# Altium project Control Logic.PrjPcb
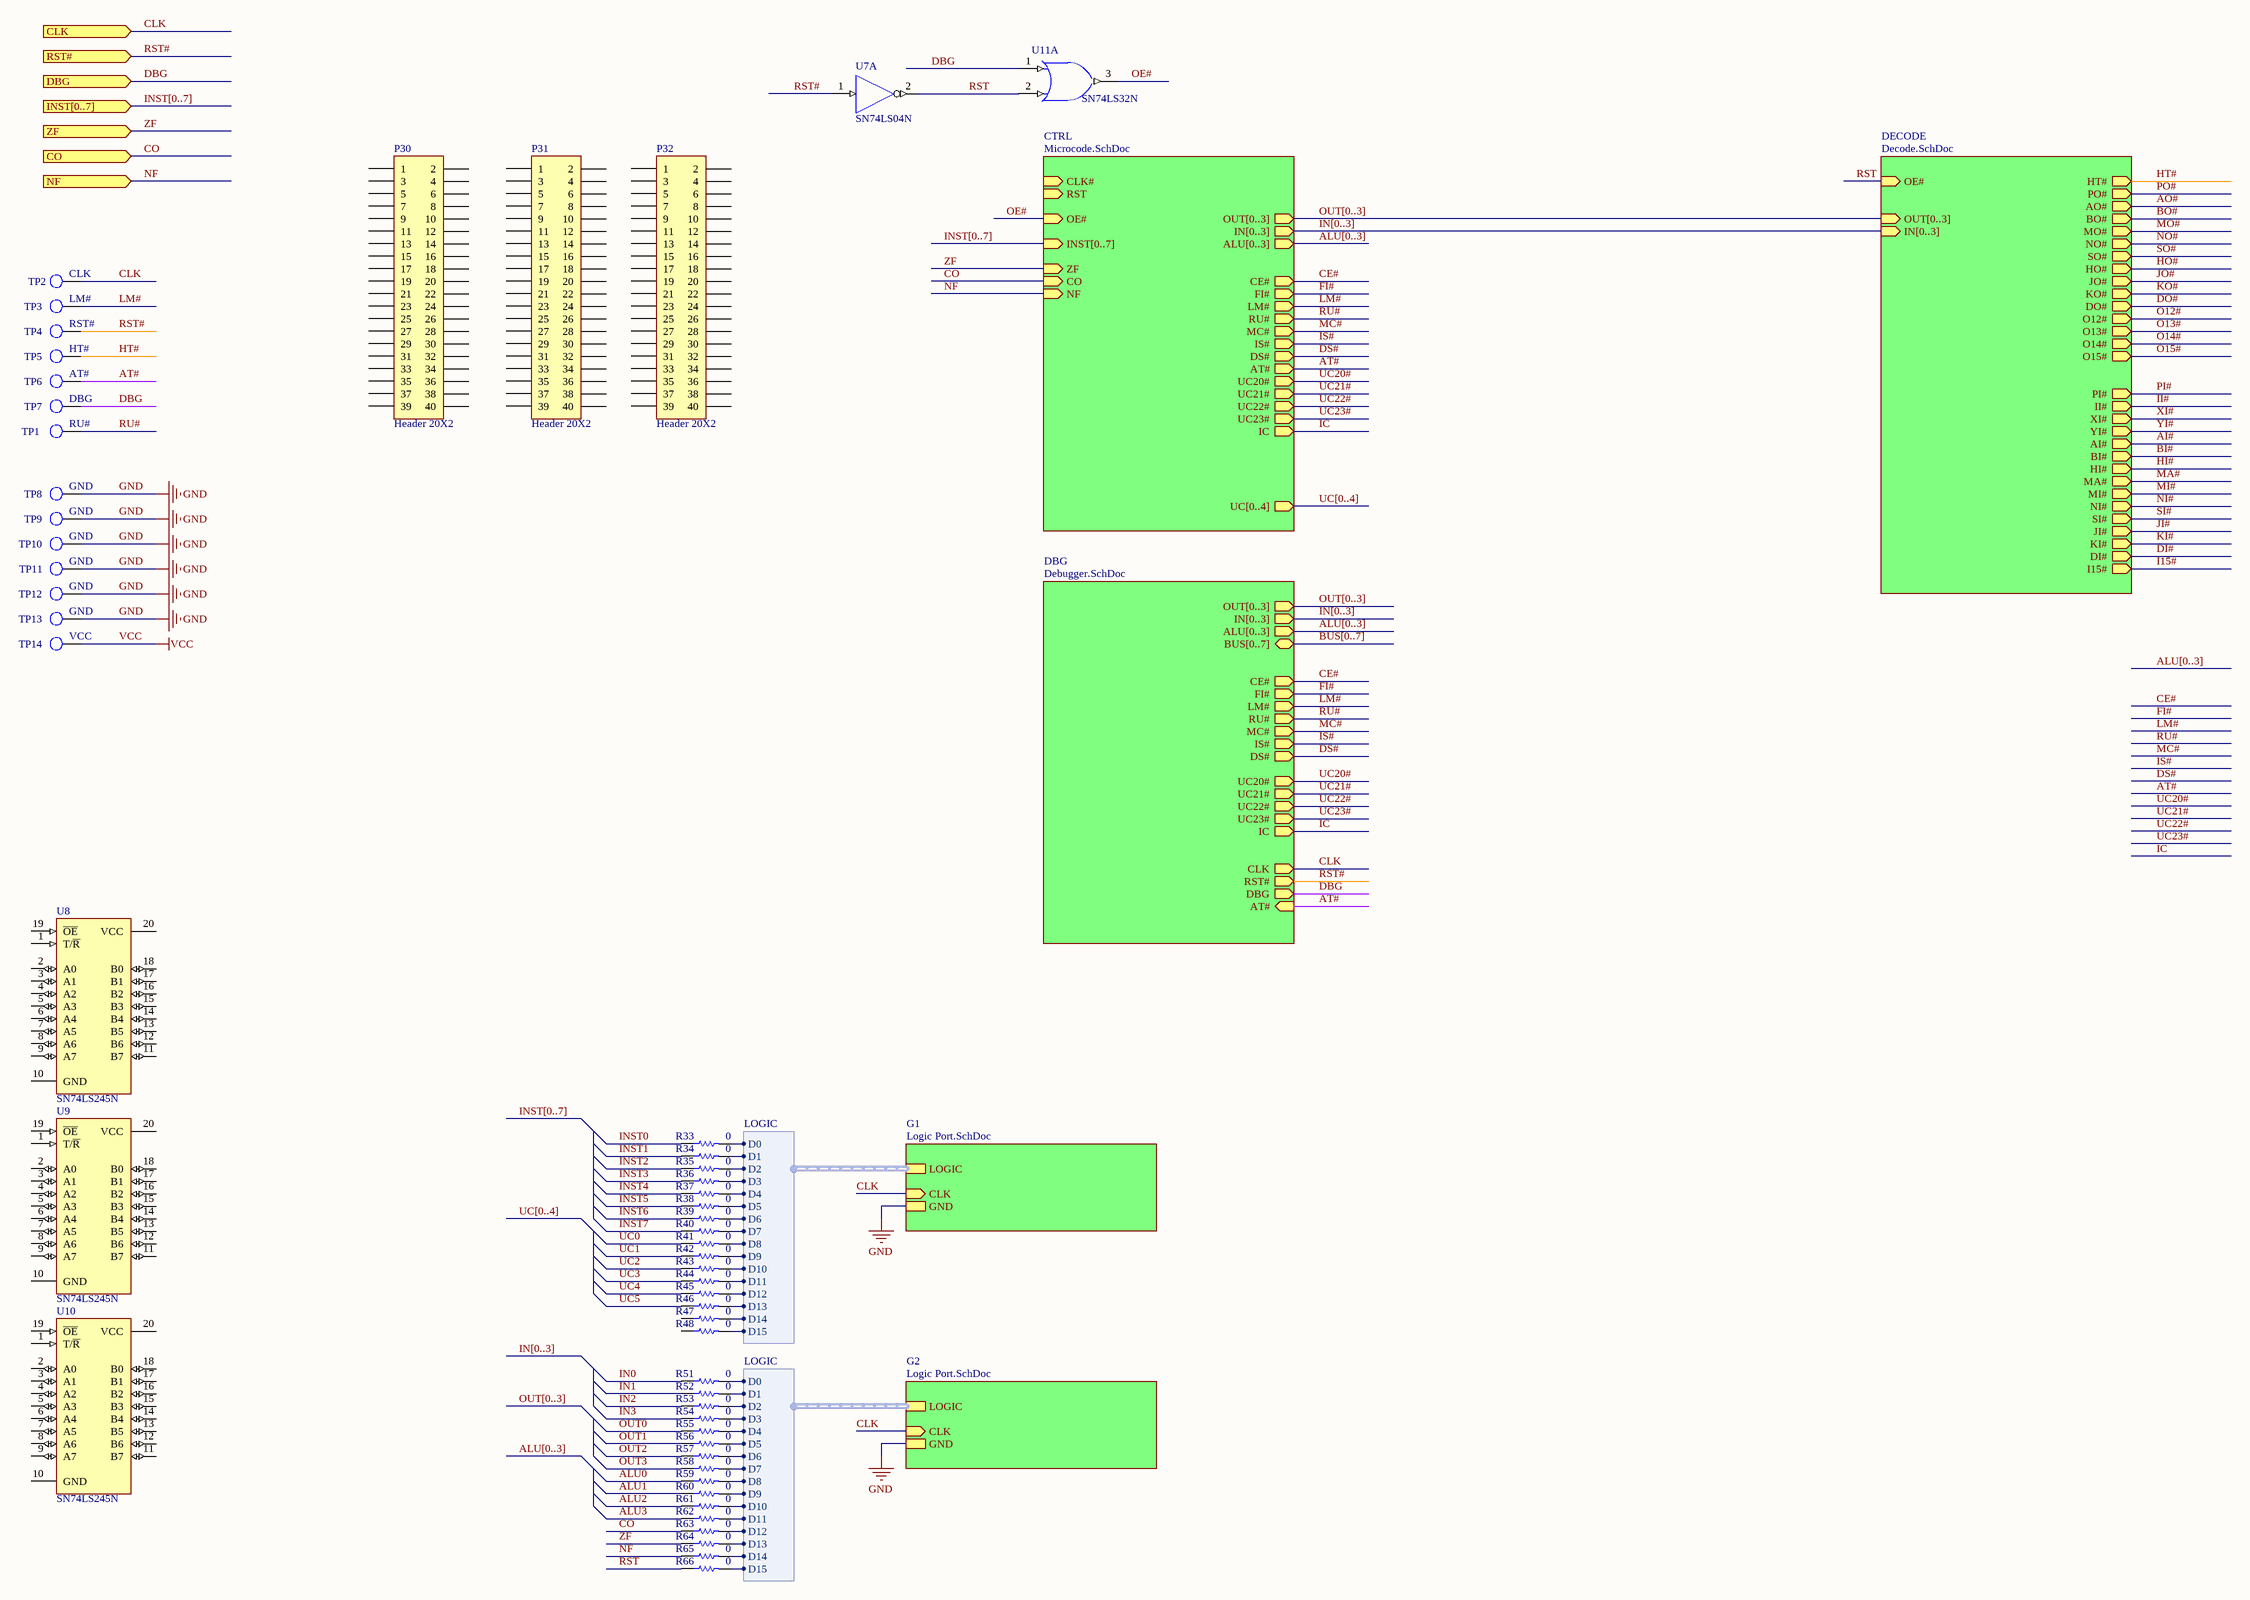
[diagram p0: Top.SchDoc]
4 sheets, 230 parts. Net scope: hierarchical (ports join the sheet entries above them; power ports are global).
Board file: Control Logic.PcbDoc
Sheets:
  Top.SchDoc
    CTRL = Microcode.SchDoc
    G1 = Logic Port.SchDoc
    DECODE = Decode.SchDoc
    G2 = Logic Port.SchDoc

## Sheet Top.SchDoc
size C; Author: E. Sims; Organization: Let's Build Rockets Inc.; SheetNumber: 1; SheetTotal: 5

### Parts
P30  Header 20X2  [HDR2X20]
P31  Header 20X2  [HDR2X20]
P32  Header 20X2  [HDR2X20]
R33  value 0  [AXIAL-0.3]  (hidden comment: Res1)
R34  value 0  [AXIAL-0.3]  (hidden comment: Res1)
R35  value 0  [AXIAL-0.3]  (hidden comment: Res1)
R36  value 0  [AXIAL-0.3]  (hidden comment: Res1)
R37  value 0  [AXIAL-0.3]  (hidden comment: Res1)
R38  value 0  [AXIAL-0.3]  (hidden comment: Res1)
R39  value 0  [AXIAL-0.3]  (hidden comment: Res1)
R40  value 0  [AXIAL-0.3]  (hidden comment: Res1)
R41  value 0  [AXIAL-0.3]  (hidden comment: Res1)
R42  value 0  [AXIAL-0.3]  (hidden comment: Res1)
R43  value 0  [AXIAL-0.3]  (hidden comment: Res1)
R44  value 0  [AXIAL-0.3]  (hidden comment: Res1)
R45  value 0  [AXIAL-0.3]  (hidden comment: Res1)
R46  value 0  [AXIAL-0.3]  (hidden comment: Res1)
R47  value 0  [AXIAL-0.3]  (hidden comment: Res1)
R48  value 0  [AXIAL-0.3]  (hidden comment: Res1)
R51  value 0  [AXIAL-0.3]  (hidden comment: Res1)
R52  value 0  [AXIAL-0.3]  (hidden comment: Res1)
R53  value 0  [AXIAL-0.3]  (hidden comment: Res1)
R54  value 0  [AXIAL-0.3]  (hidden comment: Res1)
R55  value 0  [AXIAL-0.3]  (hidden comment: Res1)
R56  value 0  [AXIAL-0.3]  (hidden comment: Res1)
R57  value 0  [AXIAL-0.3]  (hidden comment: Res1)
R58  value 0  [AXIAL-0.3]  (hidden comment: Res1)
R59  value 0  [AXIAL-0.3]  (hidden comment: Res1)
R60  value 0  [AXIAL-0.3]  (hidden comment: Res1)
R61  value 0  [AXIAL-0.3]  (hidden comment: Res1)
R62  value 0  [AXIAL-0.3]  (hidden comment: Res1)
R63  value 0  [AXIAL-0.3]  (hidden comment: Res1)
R64  value 0  [AXIAL-0.3]  (hidden comment: Res1)
R65  value 0  [AXIAL-0.3]  (hidden comment: Res1)
R66  value 0  [AXIAL-0.3]  (hidden comment: Res1)
TP1  RU#  [KSTN-5011_V]  (no BOM)
TP2  CLK  [KSTN-5011_V]  (no BOM)
TP3  LM#  [KSTN-5011_V]  (no BOM)
TP4  RST#  [KSTN-5011_V]  (no BOM)
TP5  HT#  [KSTN-5011_V]  (no BOM)
TP6  AT#  [KSTN-5011_V]  (no BOM)
TP7  DBG  [KSTN-5011_V]  (no BOM)
TP8  GND  [KSTN-5011_V]  (no BOM)
TP9  GND  [KSTN-5011_V]  (no BOM)
TP10  GND  [KSTN-5011_V]  (no BOM)
TP11  GND  [KSTN-5011_V]  (no BOM)
TP12  GND  [KSTN-5011_V]  (no BOM)
TP13  GND  [KSTN-5011_V]  (no BOM)
TP14  VCC  [KSTN-5011_V]  (no BOM)
U7  SN74LS04N  [N014]  (part A of 6)
U8  SN74LS245N  [N020]
U9  SN74LS245N  [N020]
U10  SN74LS245N  [N020]
U11  SN74LS32N  [N014]  (part A of 4)

### Sub-sheets
CTRL = Microcode.SchDoc: NF (in), RST (in), CLK# (in), ZF (in), INST[0..7] (in), CO (in), UC[0..4] (out), IN[0..3] (out), ALU[0..3] (out), OUT[0..3] (out), OE# (in), IS# (out), UC21# (out), RU# (out), AT# (out), MC# (out), CE# (out), IC (out), UC22# (out), DS# (out), FI# (out), UC23# (out), UC20# (out), LM# (out)
DBG = Debugger.SchDoc (file not in this document): IN[0..3] (out), ALU[0..3] (out), OUT[0..3] (out), IS# (out), UC21# (out), RU# (out), MC# (out), CE# (out), IC (out), UC22# (out), DS# (out), FI# (out), UC23# (out), UC20# (out), LM# (out), CLK (out), RST# (out), DBG (out), AT# (in), BUS[0..7] (bidir)
DECODE = Decode.SchDoc: IN[0..3] (in), OUT[0..3] (in), OE# (in), PO# (out), HT# (out), NO# (out), JO# (out), BO# (out), O14# (out), SO# (out), O15# (out), KO# (out), DO# (out), AO# (out), O12# (out), O13# (out), MO# (out), HO# (out), I15# (out), JI# (out), SI# (out), PI# (out), XI# (out), MI# (out), HI# (out), II# (out), DI# (out), NI# (out), BI# (out), MA# (out), YI# (out), KI# (out), AI# (out)
G1 = Logic Port.SchDoc: GND, CLK (in), LOGIC (harness LOGIC)
G2 = Logic Port.SchDoc: GND, CLK (in), LOGIC (harness LOGIC)

### Ports
CLK (in), CO (in), DBG (in), INST[0..7] (in), NF (in), RST# (in), ZF (in)

### Harnesses
LOGIC: D0, D1, D2, D3, D4, D5, D6, D7, D8, D9, D10, D11, D12, D13, D14, D15

### Nets
GND: TP8.1 TP9.1 TP10.1 TP11.1 TP12.1 TP13.1 U7.7(GND) U11.7(GND) ; sheet G1/GND, sheet G2/GND
VCC: TP14.1 U7.14(VCC) U11.14(VCC)
ALU0: R59.1
ALU1: R60.1
ALU2: R61.1
ALU3: R62.1
AT#: TP6.1 ; sheet CTRL/AT#, sheet DBG/AT#
CE#: sheet CTRL/CE#, sheet DBG/CE#
CLK: TP2.1 ; port CLK, sheet G1/CLK, sheet G2/CLK, sheet DBG/CLK
CO: R63.1 ; port CO, sheet CTRL/CO
DBG: TP7.1 U11.1(A) ; port DBG, sheet DBG/DBG
DS#: sheet CTRL/DS#, sheet DBG/DS#
FI#: sheet CTRL/FI#, sheet DBG/FI#
HT#: TP5.1 ; sheet DECODE/HT#
IC: sheet CTRL/IC, sheet DBG/IC
IN0: R51.1
IN1: R52.1
IN2: R53.1
IN3: R54.1
INST0: R33.1
INST1: R34.1
INST2: R35.1
INST3: R36.1
INST4: R37.1
INST5: R38.1
INST6: R39.1
INST7: R40.1
IS#: sheet CTRL/IS#, sheet DBG/IS#
LM#: TP3.1 ; sheet CTRL/LM#, sheet DBG/LM#
LOGIC.D0: R33.2 ; sheet G1/LOGIC.D0
LOGIC.D0: R51.2 ; sheet G2/LOGIC.D0  [a separate net that carries the same name]
LOGIC.D1: R34.2 ; sheet G1/LOGIC.D1
LOGIC.D1: R52.2 ; sheet G2/LOGIC.D1  [a separate net that carries the same name]
LOGIC.D2: R35.2 ; sheet G1/LOGIC.D2
LOGIC.D2: R53.2 ; sheet G2/LOGIC.D2  [a separate net that carries the same name]
LOGIC.D3: R36.2 ; sheet G1/LOGIC.D3
LOGIC.D3: R54.2 ; sheet G2/LOGIC.D3  [a separate net that carries the same name]
LOGIC.D4: R37.2 ; sheet G1/LOGIC.D4
LOGIC.D4: R55.2 ; sheet G2/LOGIC.D4  [a separate net that carries the same name]
LOGIC.D5: R38.2 ; sheet G1/LOGIC.D5
LOGIC.D5: R56.2 ; sheet G2/LOGIC.D5  [a separate net that carries the same name]
LOGIC.D6: R39.2 ; sheet G1/LOGIC.D6
LOGIC.D6: R57.2 ; sheet G2/LOGIC.D6  [a separate net that carries the same name]
LOGIC.D7: R40.2 ; sheet G1/LOGIC.D7
LOGIC.D7: R58.2 ; sheet G2/LOGIC.D7  [a separate net that carries the same name]
LOGIC.D8: R41.2 ; sheet G1/LOGIC.D8
LOGIC.D8: R59.2 ; sheet G2/LOGIC.D8  [a separate net that carries the same name]
LOGIC.D9: R42.2 ; sheet G1/LOGIC.D9
LOGIC.D9: R60.2 ; sheet G2/LOGIC.D9  [a separate net that carries the same name]
LOGIC.D10: R43.2 ; sheet G1/LOGIC.D10
LOGIC.D10: R61.2 ; sheet G2/LOGIC.D10  [a separate net that carries the same name]
LOGIC.D11: R44.2 ; sheet G1/LOGIC.D11
LOGIC.D11: R62.2 ; sheet G2/LOGIC.D11  [a separate net that carries the same name]
LOGIC.D12: R45.2 ; sheet G1/LOGIC.D12
LOGIC.D12: R63.2 ; sheet G2/LOGIC.D12  [a separate net that carries the same name]
LOGIC.D13: R46.2 ; sheet G1/LOGIC.D13
LOGIC.D13: R64.2 ; sheet G2/LOGIC.D13  [a separate net that carries the same name]
LOGIC.D14: R47.2 ; sheet G1/LOGIC.D14
LOGIC.D14: R65.2 ; sheet G2/LOGIC.D14  [a separate net that carries the same name]
LOGIC.D15: R48.2 ; sheet G1/LOGIC.D15
LOGIC.D15: R66.2 ; sheet G2/LOGIC.D15  [a separate net that carries the same name]
MC#: sheet CTRL/MC#, sheet DBG/MC#
NF: R65.1 ; port NF, sheet CTRL/NF
OE#: U11.3(Y) ; sheet CTRL/OE#
OUT0: R55.1
OUT1: R56.1
OUT2: R57.1
OUT3: R58.1
RST: R66.1 U7.2(Y) U11.2(B) ; sheet DECODE/OE#  [project net OE#]
RST#: TP4.1 U7.1(A) ; port RST#, sheet DBG/RST#
RU#: TP1.1 ; sheet CTRL/RU#, sheet DBG/RU#
UC0: R41.1
UC1: R42.1
UC2: R43.1
UC3: R44.1
UC4: R45.1
UC5: R46.1
UC20#: sheet CTRL/UC20#, sheet DBG/UC20#
UC21#: sheet CTRL/UC21#, sheet DBG/UC21#
UC22#: sheet CTRL/UC22#, sheet DBG/UC22#
UC23#: sheet CTRL/UC23#, sheet DBG/UC23#
ZF: R64.1 ; port ZF, sheet CTRL/ZF

Not connected (* = marked no-connect by the designer): P30 1 2 3 4 5 6 7 8 9 10 11 12 13 14 15 16 17 18 19 20 21 22 23 24 25 26 27 28 29 30 31 32 33 34 35 36 37 38 39 40; P31 1 2 3 4 5 6 7 8 9 10 11 12 13 14 15 16 17 18 19 20 21 22 23 24 25 26 27 28 29 30 31 32 33 34 35 36 37 38 39 40; P32 1 2 3 4 5 6 7 8 9 10 11 12 13 14 15 16 17 18 19 20 21 22 23 24 25 26 27 28 29 30 31 32 33 34 35 36 37 38 39 40; R47 1; R48 1; U8 1(T/~{R}) 2(A0) 3(A1) 4(A2) 5(A3) 6(A4) 7(A5) 8(A6) 9(A7) 10(GND) 11(B7) 12(B6) 13(B5) 14(B4) 15(B3) 16(B2) 17(B1) 18(B0) 19(~{OE}) 20(VCC); U9 1(T/~{R}) 2(A0) 3(A1) 4(A2) 5(A3) 6(A4) 7(A5) 8(A6) 9(A7) 10(GND) 11(B7) 12(B6) 13(B5) 14(B4) 15(B3) 16(B2) 17(B1) 18(B0) 19(~{OE}) 20(VCC); U10 1(T/~{R}) 2(A0) 3(A1) 4(A2) 5(A3) 6(A4) 7(A5) 8(A6) 9(A7) 10(GND) 11(B7) 12(B6) 13(B5) 14(B4) 15(B3) 16(B2) 17(B1) 18(B0) 19(~{OE}) 20(VCC)

### Buses and harness runs
bus ALU[0..3]
bus ALU[0..3] = sheet CTRL/ALU[0..3]
bus ALU[0..3] = sheet DBG/ALU[0..3]
bus BUS[0..7] = sheet DBG/BUS[0..7]
bus IN[0..3]
bus IN[0..3] = sheet CTRL/IN[0..3] = sheet DECODE/IN[0..3]
bus IN[0..3] = sheet DBG/IN[0..3]
bus INST[0..7]
bus INST[0..7] = port INST[0..7]
bus INST[0..7] = sheet CTRL/INST[0..7]
bus OUT[0..3]
bus OUT[0..3] = sheet CTRL/OUT[0..3] = sheet DECODE/OUT[0..3]
bus OUT[0..3] = sheet DBG/OUT[0..3]
bus UC[0..4]
bus UC[0..4] = sheet CTRL/UC[0..4]

### Notes on the sheet
- Let's Build Rocket's Inc. Modular Paylaod System Based on TMP-010 Rev
  For more information visit https://github.com/LetsBuildRockets/Modular-Payload-System
  This work is licensed under CC BY-NC 4.0. To view a copy of this license, visit https://creativecommons.org/licenses/by-nc/4.0
- Title
- Size:
- Date:
- Assembly Variant:
- B
- Number:
- Time:
- Revision:
- Sheet
- of
- Author:
- File:

### Library data of the parts
P30-P32 = Header 20X2: Header, 20-Pin, Dual row; System: Connector; LatestRevisionDate: 17-Jul-2002; LatestRevisionNote: Re-released for DXP Platform.; Publisher: Altium Limited
R33-R48 R51-R66 = Res1: Resistor; Published: 8-Jun-2000; LatestRevisionDate: 17-Jul-2002; LatestRevisionNote: Re-released for DXP Platform.; PackageReference: AXIAL-0.3; Publisher: Altium Limited; PackageDescription: Axial Device, Thru-Hole; 2 Leads; 0.3 in Pin Spacing
TP1-TP14 = TP
U7 = SN74LS04N: Hex Inverter; Published: 8-Jun-2000; LatestRevisionDate: 04-Mar-2005; LatestRevisionNote: Stylized 3D Model Added.; DatasheetVersion: Mar-1988; PackageVersion: Oct-1995; PackageReference: N014; Publisher: Altium Limited; PackageDescription: DIP; 14 Leads; Row Spacing 7.62 mm; Pitch 2.54 mm; ComponentLink1Description: Manufacturer Link; ComponentLink1URL: http://www.ti.com/; ComponentLink2Description: Datasheet; ComponentLink2URL: http://www-s.ti.com/sc/ds/sn74ls04.pdf
U8-U10 = SN74LS245N: Octal Bus Transceiver with 3-State Outputs; Published: 8-Jun-2000; LatestRevisionDate: 04-Mar-2005; LatestRevisionNote: Stylized 3D Model Added.; DatasheetVersion: Mar-1988; PackageVersion: Oct-1995; PackageReference: N020; Publisher: Altium Limited; PackageDescription: DIP; 20 Leads; Row Spacing 7.62 mm; Pitch 2.54 mm; ComponentLink1Description: Manufacturer Link; ComponentLink1URL: http://www.ti.com/; ComponentLink2Description: Datasheet; ComponentLink2URL: http://www-s.ti.com/sc/ds/sn74ls245.pdf
U11 = SN74LS32N: Quadruple 2-Input Positive-OR Gate; Published: 8-Jun-2000; LatestRevisionDate: 04-Mar-2005; LatestRevisionNote: Stylized 3D Model Added.; DatasheetVersion: Mar-1988; PackageVersion: Oct-1995; PackageReference: N014; Publisher: Altium Limited; PackageDescription: DIP; 14 Leads; Row Spacing 7.62 mm; Pitch 2.54 mm; ComponentLink1Description: Manufacturer Link; ComponentLink1URL: http://www.ti.com/; ComponentLink2Description: Datasheet; ComponentLink2URL: http://www-s.ti.com/sc/ds/sn74ls32.pdf

## Sheet Microcode.SchDoc
size B; Author: E. Sims; Organization: Let's Build Rockets Inc.; SheetNumber: 2; SheetTotal: 5
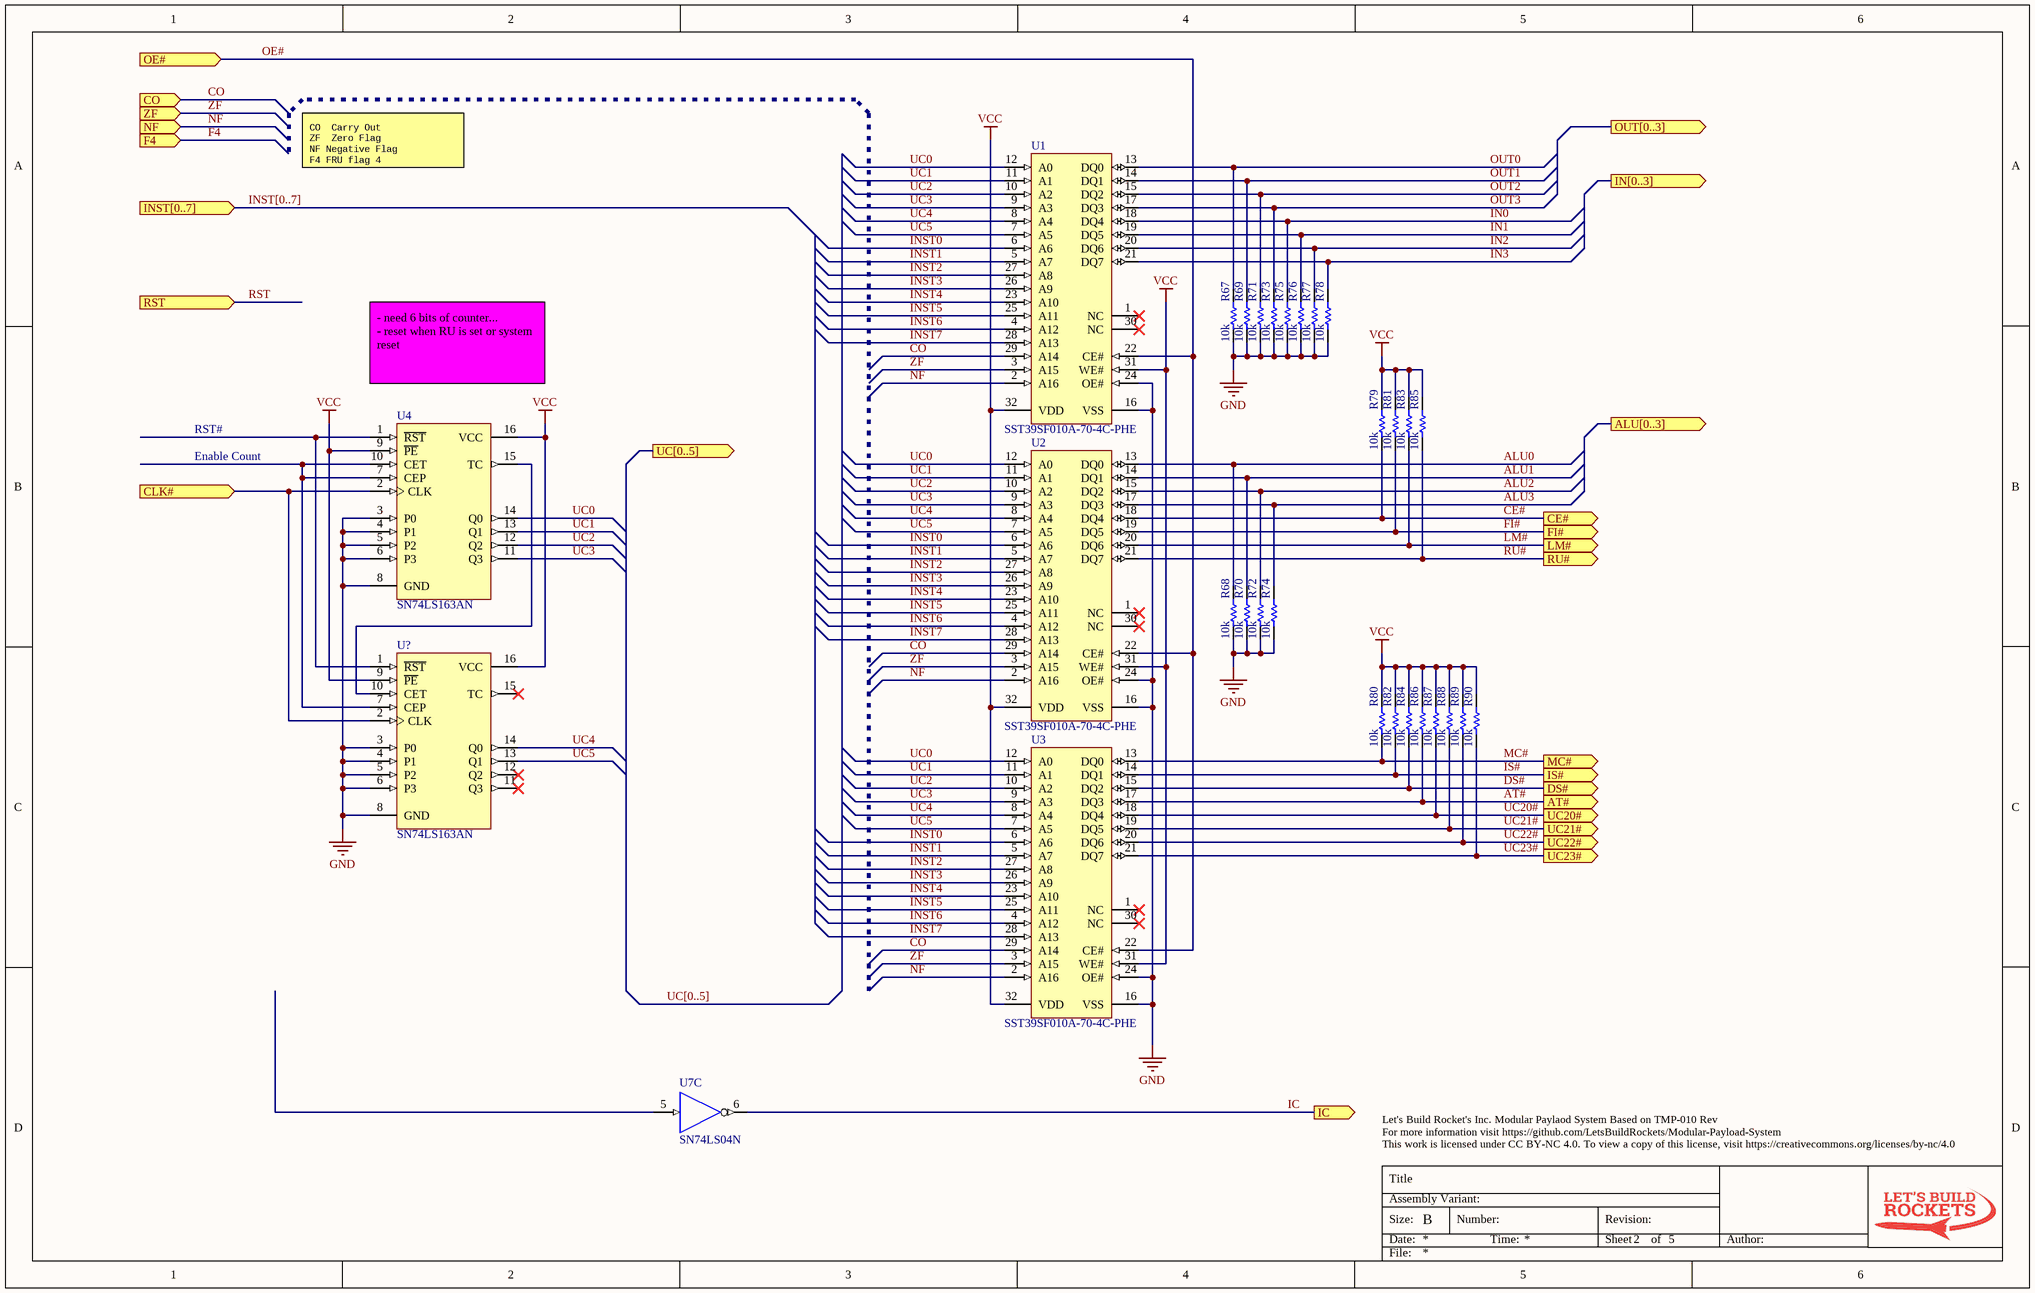
[diagram p1: Microcode.SchDoc]

### Parts
R67  value 10k  [AXIAL-0.3]  (hidden comment: Res1)
R68  value 10k  [AXIAL-0.3]  (hidden comment: Res1)
R69  value 10k  [AXIAL-0.3]  (hidden comment: Res1)
R70  value 10k  [AXIAL-0.3]  (hidden comment: Res1)
R71  value 10k  [AXIAL-0.3]  (hidden comment: Res1)
R72  value 10k  [AXIAL-0.3]  (hidden comment: Res1)
R73  value 10k  [AXIAL-0.3]  (hidden comment: Res1)
R74  value 10k  [AXIAL-0.3]  (hidden comment: Res1)
R75  value 10k  [AXIAL-0.3]  (hidden comment: Res1)
R76  value 10k  [AXIAL-0.3]  (hidden comment: Res1)
R77  value 10k  [AXIAL-0.3]  (hidden comment: Res1)
R78  value 10k  [AXIAL-0.3]  (hidden comment: Res1)
R79  value 10k  [AXIAL-0.3]  (hidden comment: Res1)
R80  value 10k  [AXIAL-0.3]  (hidden comment: Res1)
R81  value 10k  [AXIAL-0.3]  (hidden comment: Res1)
R82  value 10k  [AXIAL-0.3]  (hidden comment: Res1)
R83  value 10k  [AXIAL-0.3]  (hidden comment: Res1)
R84  value 10k  [AXIAL-0.3]  (hidden comment: Res1)
R85  value 10k  [AXIAL-0.3]  (hidden comment: Res1)
R86  value 10k  [AXIAL-0.3]  (hidden comment: Res1)
R87  value 10k  [AXIAL-0.3]  (hidden comment: Res1)
R88  value 10k  [AXIAL-0.3]  (hidden comment: Res1)
R89  value 10k  [AXIAL-0.3]  (hidden comment: Res1)
R90  value 10k  [AXIAL-0.3]  (hidden comment: Res1)
U1  SST39SF010A-70-4C-PHE  [MCHP-PDIP-PH32]
U2  SST39SF010A-70-4C-PHE  [MCHP-PDIP-PH32]
U3  SST39SF010A-70-4C-PHE  [MCHP-PDIP-PH32]
U4  SN74LS163AN  [N016]
U7  SN74LS04N  [N014]  (part C of 6)
U?  SN74LS163AN  [N016]

### Ports
ALU[0..3] (out), AT# (out), CE# (out), CLK# (in), CO (in), DS# (out), F4 (in), FI# (out), IC (out), IN[0..3] (out), INST[0..7] (in), IS# (out), LM# (out), MC# (out), NF (in), OE# (in), OUT[0..3] (out), RST (in), RU# (out), UC20# (out), UC21# (out), UC22# (out), UC23# (out), UC[0..5] (out), ZF (in)

### Nets
GND: R67.1 R68.1 R69.1 R70.1 R71.1 R72.1 R73.1 R74.1 R75.1 R76.1 R77.1 R78.1 U1.16(VSS) U1.24(OE#) U2.16(VSS) U2.24(OE#) U3.16(VSS) U3.24(OE#) U4.3(P0) U4.4(P1) U4.5(P2) U4.6(P3) U4.8(GND) U7.7(GND) U?.3(P0) U?.4(P1) U?.5(P2) U?.6(P3) U?.8(GND)
VCC: R79.2 R80.2 R81.2 R82.2 R83.2 R84.2 R85.2 R86.2 R87.2 R88.2 R89.2 R90.2 U1.31(WE#) U1.32(VDD) U2.31(WE#) U2.32(VDD) U3.31(WE#) U3.32(VDD) U4.9(~{PE}) U4.16(VCC) U7.14(VCC) U?.9(~{PE}) U?.16(VCC)
ALU0: R68.2 U2.13(DQ0)
ALU1: R70.2 U2.14(DQ1)
ALU2: R72.2 U2.15(DQ2)
ALU3: R74.2 U2.17(DQ3)
AT#: R86.1 U3.17(DQ3) ; port AT#
CE#: R79.1 U2.18(DQ4) ; port CE#
CO: U1.29(A14) U2.29(A14) U3.29(A14) ; port CO
DS#: R84.1 U3.15(DQ2) ; port DS#
F4: port F4
FI#: R81.1 U2.19(DQ5) ; port FI#
IC: U7.6(Y) ; port IC
IN0: R75.2 U1.18(DQ4)
IN1: R76.2 U1.19(DQ5)
IN2: R77.2 U1.20(DQ6)
IN3: R78.2 U1.21(DQ7)
INST0: U1.6(A6) U2.6(A6) U3.6(A6)
INST1: U1.5(A7) U2.5(A7) U3.5(A7)
INST2: U1.27(A8) U2.27(A8) U3.27(A8)
INST3: U1.26(A9) U2.26(A9) U3.26(A9)
INST4: U1.23(A10) U2.23(A10) U3.23(A10)
INST5: U1.25(A11) U2.25(A11) U3.25(A11)
INST6: U1.4(A12) U2.4(A12) U3.4(A12)
INST7: U1.28(A13) U2.28(A13) U3.28(A13)
IS#: R82.1 U3.14(DQ1) ; port IS#
LM#: R83.1 U2.20(DQ6) ; port LM#
MC#: R80.1 U3.13(DQ0) ; port MC#
NF: U1.2(A16) U2.2(A16) U3.2(A16) ; port NF
OE#: U1.22(CE#) U2.22(CE#) U3.22(CE#) ; port OE#
OUT0: R67.2 U1.13(DQ0)
OUT1: R69.2 U1.14(DQ1)
OUT2: R71.2 U1.15(DQ2)
OUT3: R73.2 U1.17(DQ3)
RST: port RST
RU#: R85.1 U2.21(DQ7) ; port RU#
UC0: U1.12(A0) U2.12(A0) U3.12(A0) U4.14(Q0)
UC1: U1.11(A1) U2.11(A1) U3.11(A1) U4.13(Q1)
UC2: U1.10(A2) U2.10(A2) U3.10(A2) U4.12(Q2)
UC3: U1.9(A3) U2.9(A3) U3.9(A3) U4.11(Q3)
UC4: U1.8(A4) U2.8(A4) U3.8(A4) U?.14(Q0)
UC5: U1.7(A5) U2.7(A5) U3.7(A5) U?.13(Q1)
UC20#: R87.1 U3.18(DQ4) ; port UC20#
UC21#: R88.1 U3.19(DQ5) ; port UC21#
UC22#: R89.1 U3.20(DQ6) ; port UC22#
UC23#: R90.1 U3.21(DQ7) ; port UC23#
ZF: U1.3(A15) U2.3(A15) U3.3(A15) ; port ZF
NetU4_1: U4.1(~{RST}) U?.1(~{RST})
NetU4_2: U4.2(CLK) U?.2(CLK) ; port CLK#
NetU4_7: U4.7(CEP) U4.10(CET) U?.7(CEP)
NetU4_15: U4.15(TC) U?.10(CET)

Not connected (* = marked no-connect by the designer): U1 1(NC)* 30(NC)*; U2 1(NC)* 30(NC)*; U3 1(NC)* 30(NC)*; U7 5(A); U? 11(Q3)* 12(Q2)* 15(TC)*

### Buses and harness runs
bus INST[0..7] = port INST[0..7]
bus UC[0..5] = port UC[0..5]

### Notes on the sheet
- CO  Carry Out
  ZF  Zero Flag
  NF Negative Flag
  F4 FRU flag 4
- RST#
- - need 6 bits of counter...
  - reset when RU is set or system reset
- Enable Count
- Let's Build Rocket's Inc. Modular Paylaod System Based on TMP-010 Rev
  For more information visit https://github.com/LetsBuildRockets/Modular-Payload-System
  This work is licensed under CC BY-NC 4.0. To view a copy of this license, visit https://creativecommons.org/licenses/by-nc/4.0
- Title
- Size:
- Date:
- Assembly Variant:
- B
- Number:
- Time:
- Revision:
- Sheet
- of
- Author:
- File:

### Library data of the parts
R67-R90 = Res1: Resistor; Published: 8-Jun-2000; LatestRevisionDate: 17-Jul-2002; LatestRevisionNote: Re-released for DXP Platform.; PackageReference: AXIAL-0.3; Publisher: Altium Limited; PackageDescription: Axial Device, Thru-Hole; 2 Leads; 0.3 in Pin Spacing
U1-U3 = CMP-0378-00001-1: 1 Mbit Multi-Purpose Flash, 4.5 to 5.5 V, 1 kHz, 0 to 70 degC, 32-pin PDIP (PH32), Tube; Manufacturer: Microchip; ComponentLink3Description: Package Specification; ComponentLink1URL: http://www.microchip.com; ComponentLink2Description: Datasheet; PackageReference: PDIP-PH32; ComponentLink2URL: http://ww1.microchip.com/downloads/en/DeviceDoc/25022A.pdf; DatasheetVersion: Rev. A; ComponentLink3URL: http://ww1.microchip.com/downloads/en/DeviceDoc/25022A.pdf; ComponentLink4Description: Product URL; ComponentLink1Description: Manufacturer URL; PartNumber: SST39SF010A-70-4C-PHE; ComponentLink4URL: http://www.microchip.com/SST39SF010A; PackageDescription: 32-Pin Plastic Dual In-line Pins, Row Spacing 15.24 mm, 41.91 x 13.72 mm Body, 2.54 mm Pitch; Code_JEDEC: MO-015; Mounting Technology: Through Hole; PackageVersion: Rev. A
U4 U? = SN74LS163AN: Synchronous 4-Bit Counter; Published: 8-Jun-2000; LatestRevisionDate: 04-Mar-2005; LatestRevisionNote: Stylized 3D Model Added.; DatasheetVersion: Mar-1988; PackageVersion: Oct-1995; PackageReference: N016; Publisher: Altium Limited; PackageDescription: DIP; 16 Leads; Row Spacing 7.62 mm; Pitch 2.54 mm; ComponentLink1Description: Manufacturer Link; ComponentLink1URL: http://www.ti.com/; ComponentLink2Description: Datasheet; ComponentLink2URL: http://www-s.ti.com/sc/ds/sn74ls161a.pdf; ComponentLink3Description: URL Link1; ComponentLink3URL: http://focus.ti.com/docs/prod/folders/print/sn74ls163a.html; Code_JEDEC: MS-001-BB
U7 = SN74LS04N: Hex Inverter; Published: 8-Jun-2000; LatestRevisionDate: 04-Mar-2005; LatestRevisionNote: Stylized 3D Model Added.; DatasheetVersion: Mar-1988; PackageVersion: Oct-1995; PackageReference: N014; Publisher: Altium Limited; PackageDescription: DIP; 14 Leads; Row Spacing 7.62 mm; Pitch 2.54 mm; ComponentLink1Description: Manufacturer Link; ComponentLink1URL: http://www.ti.com/; ComponentLink2Description: Datasheet; ComponentLink2URL: http://www-s.ti.com/sc/ds/sn74ls04.pdf

## Sheet Logic Port.SchDoc
size B; Author: E. Sims; Organization: Let's Build Rockets Inc.; SheetNumber: 4; SheetTotal: 4
Used 2 times, as channels G1, G2. Parts and nets are listed once, with the designators drawn on the sheet.
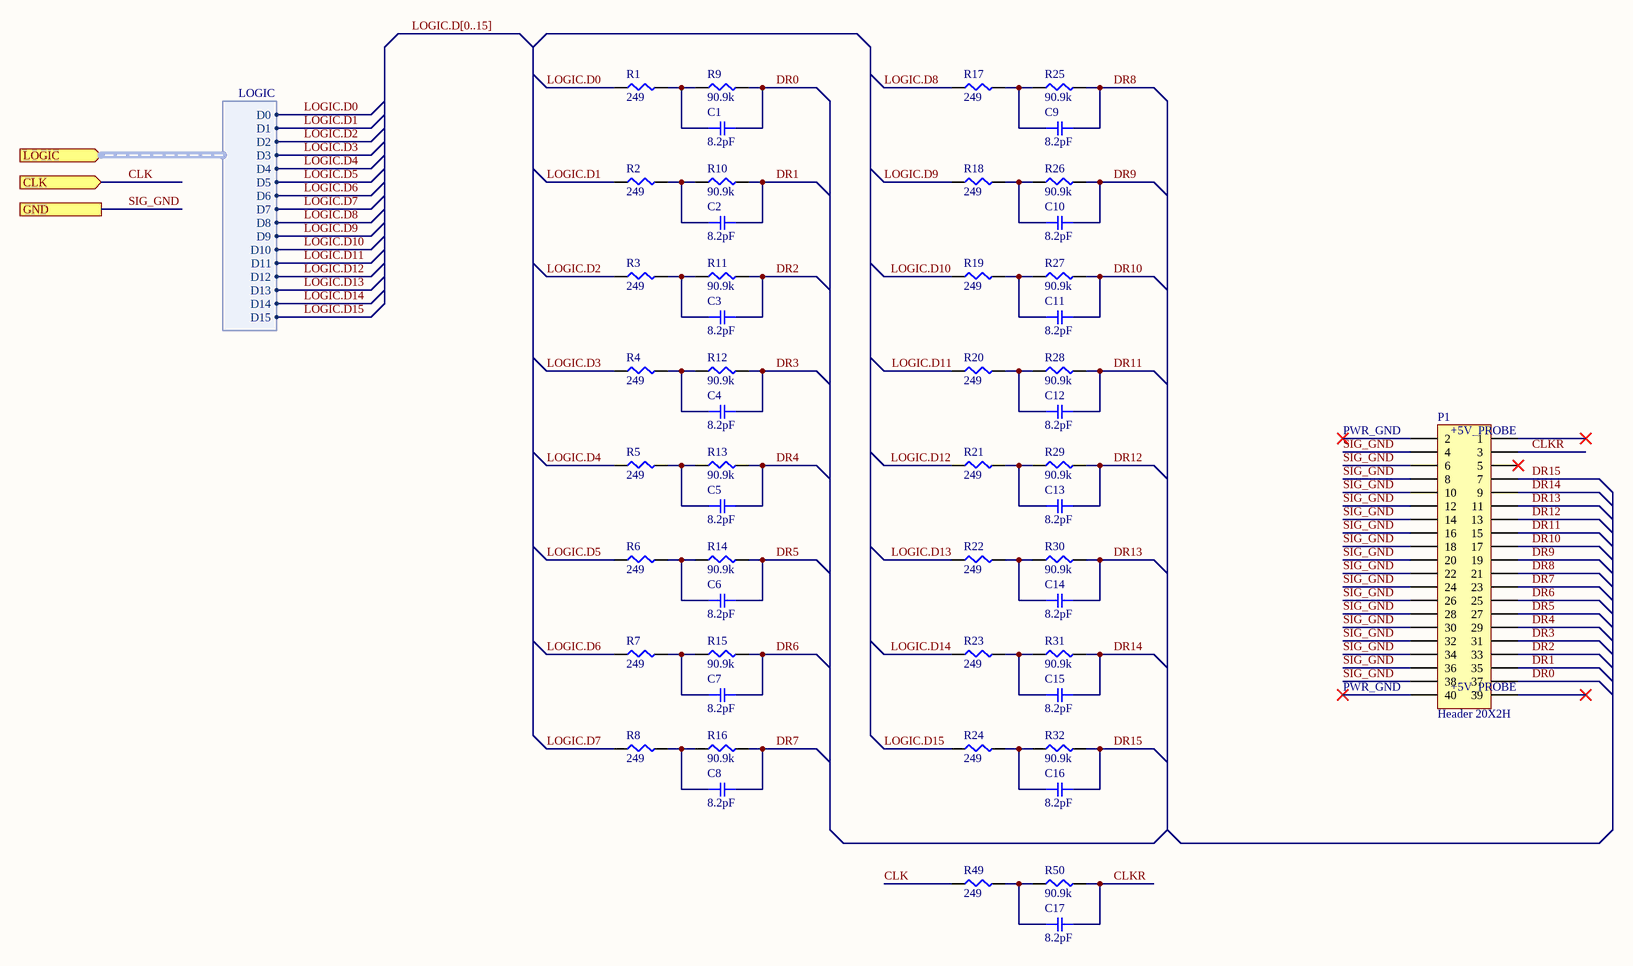
[diagram p2: Logic Port.SchDoc]

### Parts
C1  8.2pF  [SMD-0603C]
C2  8.2pF  [SMD-0603C]
C3  8.2pF  [SMD-0603C]
C4  8.2pF  [SMD-0603C]
C5  8.2pF  [SMD-0603C]
C6  8.2pF  [SMD-0603C]
C7  8.2pF  [SMD-0603C]
C8  8.2pF  [SMD-0603C]
C9  8.2pF  [SMD-0603C]
C10  8.2pF  [SMD-0603C]
C11  8.2pF  [SMD-0603C]
C12  8.2pF  [SMD-0603C]
C13  8.2pF  [SMD-0603C]
C14  8.2pF  [SMD-0603C]
C15  8.2pF  [SMD-0603C]
C16  8.2pF  [SMD-0603C]
C17  8.2pF  [SMD-0603C]
P1  Header 20X2H  [HDR2X20H]
R1  249  [SMD-0603-RES]
R2  249  [SMD-0603-RES]
R3  249  [SMD-0603-RES]
R4  249  [SMD-0603-RES]
R5  249  [SMD-0603-RES]
R6  249  [SMD-0603-RES]
R7  249  [SMD-0603-RES]
R8  249  [SMD-0603-RES]
R9  value 90.9k  [SMD-0603-RES]
R10  90.9k  [SMD-0603-RES]
R11  90.9k  [SMD-0603-RES]
R12  90.9k  [SMD-0603-RES]
R13  90.9k  [SMD-0603-RES]
R14  90.9k  [SMD-0603-RES]
R15  90.9k  [SMD-0603-RES]
R16  90.9k  [SMD-0603-RES]
R17  249  [SMD-0603-RES]
R18  249  [SMD-0603-RES]
R19  249  [SMD-0603-RES]
R20  249  [SMD-0603-RES]
R21  249  [SMD-0603-RES]
R22  249  [SMD-0603-RES]
R23  249  [SMD-0603-RES]
R24  249  [SMD-0603-RES]
R25  90.9k  [SMD-0603-RES]
R26  90.9k  [SMD-0603-RES]
R27  90.9k  [SMD-0603-RES]
R28  90.9k  [SMD-0603-RES]
R29  90.9k  [SMD-0603-RES]
R30  90.9k  [SMD-0603-RES]
R31  90.9k  [SMD-0603-RES]
R32  90.9k  [SMD-0603-RES]
R49  249  [SMD-0603-RES]
R50  90.9k  [SMD-0603-RES]

### Ports
CLK (in), GND, LOGIC (in, harness LOGIC)

### Harnesses
LOGIC: D0, D1, D2, D3, D4, D5, D6, D7, D8, D9, D10, D11, D12, D13, D14, D15

### Nets
CLK: R49.1 ; port CLK
CLKR: C17.2 P1.3 R50.2
DR0: C1.2 P1.37 R9.2
DR1: C2.2 P1.35 R10.2
DR2: C3.2 P1.33 R11.2
DR3: C4.2 P1.31 R12.2
DR4: C5.2 P1.29 R13.2
DR5: C6.2 P1.27 R14.2
DR6: C7.2 P1.25 R15.2
DR7: C8.2 P1.23 R16.2
DR8: C9.2 P1.21 R25.2
DR9: C10.2 P1.19 R26.2
DR10: C11.2 P1.17 R27.2
DR11: C12.2 P1.15 R28.2
DR12: C13.2 P1.13 R29.2
DR13: C14.2 P1.11 R30.2
DR14: C15.2 P1.9 R31.2
DR15: C16.2 P1.7 R32.2
LOGIC.D0: R1.1 ; port LOGIC.D0
LOGIC.D1: R2.1 ; port LOGIC.D1
LOGIC.D2: R3.1 ; port LOGIC.D2
LOGIC.D3: R4.1 ; port LOGIC.D3
LOGIC.D4: R5.1 ; port LOGIC.D4
LOGIC.D5: R6.1 ; port LOGIC.D5
LOGIC.D6: R7.1 ; port LOGIC.D6
LOGIC.D7: R8.1 ; port LOGIC.D7
LOGIC.D8: R17.1 ; port LOGIC.D8
LOGIC.D9: R18.1 ; port LOGIC.D9
LOGIC.D10: R19.1 ; port LOGIC.D10
LOGIC.D11: R20.1 ; port LOGIC.D11
LOGIC.D12: R21.1 ; port LOGIC.D12
LOGIC.D13: R22.1 ; port LOGIC.D13
LOGIC.D14: R23.1 ; port LOGIC.D14
LOGIC.D15: R24.1 ; port LOGIC.D15
SIG_GND: P1.4 P1.6 P1.8 P1.10 P1.12 P1.14 P1.16 P1.18 P1.20 P1.22 P1.24 P1.26 P1.28 P1.30 P1.32 P1.34 P1.36 P1.38 ; port GND
NetC1_1: C1.1 R1.2 R9.1
NetC2_1: C2.1 R2.2 R10.1
NetC3_1: C3.1 R3.2 R11.1
NetC4_1: C4.1 R4.2 R12.1
NetC5_1: C5.1 R5.2 R13.1
NetC6_1: C6.1 R6.2 R14.1
NetC7_1: C7.1 R7.2 R15.1
NetC8_1: C8.1 R8.2 R16.1
NetC9_1: C9.1 R17.2 R25.1
NetC10_1: C10.1 R18.2 R26.1
NetC11_1: C11.1 R19.2 R27.1
NetC12_1: C12.1 R20.2 R28.1
NetC13_1: C13.1 R21.2 R29.1
NetC14_1: C14.1 R22.2 R30.1
NetC15_1: C15.1 R23.2 R31.1
NetC16_1: C16.1 R24.2 R32.1
NetC17_1: C17.1 R49.2 R50.1

Not connected (* = marked no-connect by the designer): P1 1* 2* 5* 39* 40*

### Channels
G1: designators end in _G1; ports CLK=CLK GND=GND
G2: designators end in _G2; ports CLK=CLK GND=GND

### Buses and harness runs
bus LOGIC.D[0..15]

### Notes on the sheet
- (near P1) PWR_GND
- (near P1) +5V_PROBE
- Let's Build Rocket's Inc. Modular Paylaod System Based on TMP-010 Rev
  For more information visit https://github.com/LetsBuildRockets/Modular-Payload-System
  This work is licensed under CC BY-NC 4.0. To view a copy of this license, visit https://creativecommons.org/licenses/by-nc/4.0
- Title
- Size:
- Date:
- Assembly Variant:
- B
- Number:
- Time:
- Revision:
- Sheet
- of
- Author:
- File:

### Library data of the parts
C1-C17 = GRM1885C1H8R2BA01D: CAP CER 8.2PF 50V NP0 0603; Manufacturer: Murata Electronics North America; Factory Stock: 0; Unit Price (USD): 0.11; Minimum Quantity: 1; Tolerance: ±0.1pF; Temperature Coefficient: C0G, NP0; Datasheets: http://www.murata.com/~/media/webrenewal/support/library/catalog/products/capacitor/mlcc/c02e.pdf; Image: //media.digikey.com/Renders/Murata%20Renders/ZRB-SERIES-0402.jpg; Digi-Key Part Number: 490-12727-1-ND; Part Number: GRM1885C1H8R2BA01D; Quantity Available: 816; @ qty: 0; Packaging: Cut Tape (CT); Series: GRM; Part Status: Active; Value: 8.2pF; Voltage: 50V; Operating Temperature: -55°C ~ 125°C; Features: -; Ratings: -; Applications: General Purpose; Mounting Type: Surface Mount, MLCC; Package / Case: 0603 (1608 Metric); Size / Dimension: 0.063" L x 0.031" W (1.60mm x 0.80mm); Height - Seated (Max): -; Thickness (Max): 0.035" (0.90mm); Lead Spacing: -; Lead Style: -
P1 = Header 20X2H: Header, 20-Pin, Dual row, Right Angle; LatestRevisionDate: 17-Jul-2002; LatestRevisionNote: Re-released for DXP Platform.; Publisher: Altium Limited
R1-R8 R17-R24 R49 = ERJ-3EKF2490V: RES SMD 249 OHM 1% 1/10W 0603; Manufacturer: Panasonic Electronic Components; Factory Stock: 0; Unit Price (USD): 0.00379; @ qty: 1500; Minimum Quantity: 1; Power (Watts): 0.1W, 1/10W; Temperature Coefficient: ±100ppm/°C; Value: 249; Part Number: ERJ-3EKF2490V; Datasheets: http://industrial.panasonic.com/www-cgi/jvcr13pz.cgi?E+PZ+3+AOA0002+ERJ3EKF2490V+7+WW; Image: //media.digikey.com/Photos/Panasonic%20Photos/MFG_ERJ-P6W%20Series.jpg; Digi-Key Part Number: P249HCT-ND; Quantity Available: 112432; Packaging: Cut Tape (CT); Series: ERJ; Part Status: Active; Tolerance: ±1%; Composition: Thick Film; Features: Automotive AEC-Q200; Operating Temperature: -55°C ~ 155°C; Package / Case: 0603 (1608 Metric); Supplier Device Package: 0603; Size / Dimension: 0.063" L x 0.031" W (1.60mm x 0.80mm); Height - Seated (Max): 0.022" (0.55mm); Number of Terminations: 2; Failure Rate: -
R9-R16 R25-R32 R50 = ERJ-3EKF9092V: RES SMD 90.9K OHM 1% 1/10W 0603; Manufacturer: Panasonic Electronic Components; Factory Stock: 0; Unit Price (USD): 0.00379; @ qty: 1500; Minimum Quantity: 1; Power (Watts): 0.1W, 1/10W; Temperature Coefficient: ±100ppm/°C; Part Number: ERJ-3EKF9092V; Datasheets: http://industrial.panasonic.com/www-cgi/jvcr13pz.cgi?E+PZ+3+AOA0002+ERJ3EKF9092V+7+WW; Image: //media.digikey.com/Photos/Panasonic%20Photos/MFG_ERJ-P6W%20Series.jpg; Digi-Key Part Number: P90.9KHCT-ND; Quantity Available: 254781; Packaging: Cut Tape (CT); Series: ERJ; Part Status: Active; Tolerance: ±1%; Composition: Thick Film; Features: Automotive AEC-Q200; Operating Temperature: -55°C ~ 155°C; Package / Case: 0603 (1608 Metric); Supplier Device Package: 0603; Size / Dimension: 0.063" L x 0.031" W (1.60mm x 0.80mm); Height - Seated (Max): 0.022" (0.55mm); Number of Terminations: 2; Failure Rate: -
  R10-R16 R25-R32 R50: Value: 90.9k

## Sheet Decode.SchDoc
size B; Author: E. Sims; Organization: Let's Build Rockets Inc.; SheetNumber: 3; SheetTotal: 5
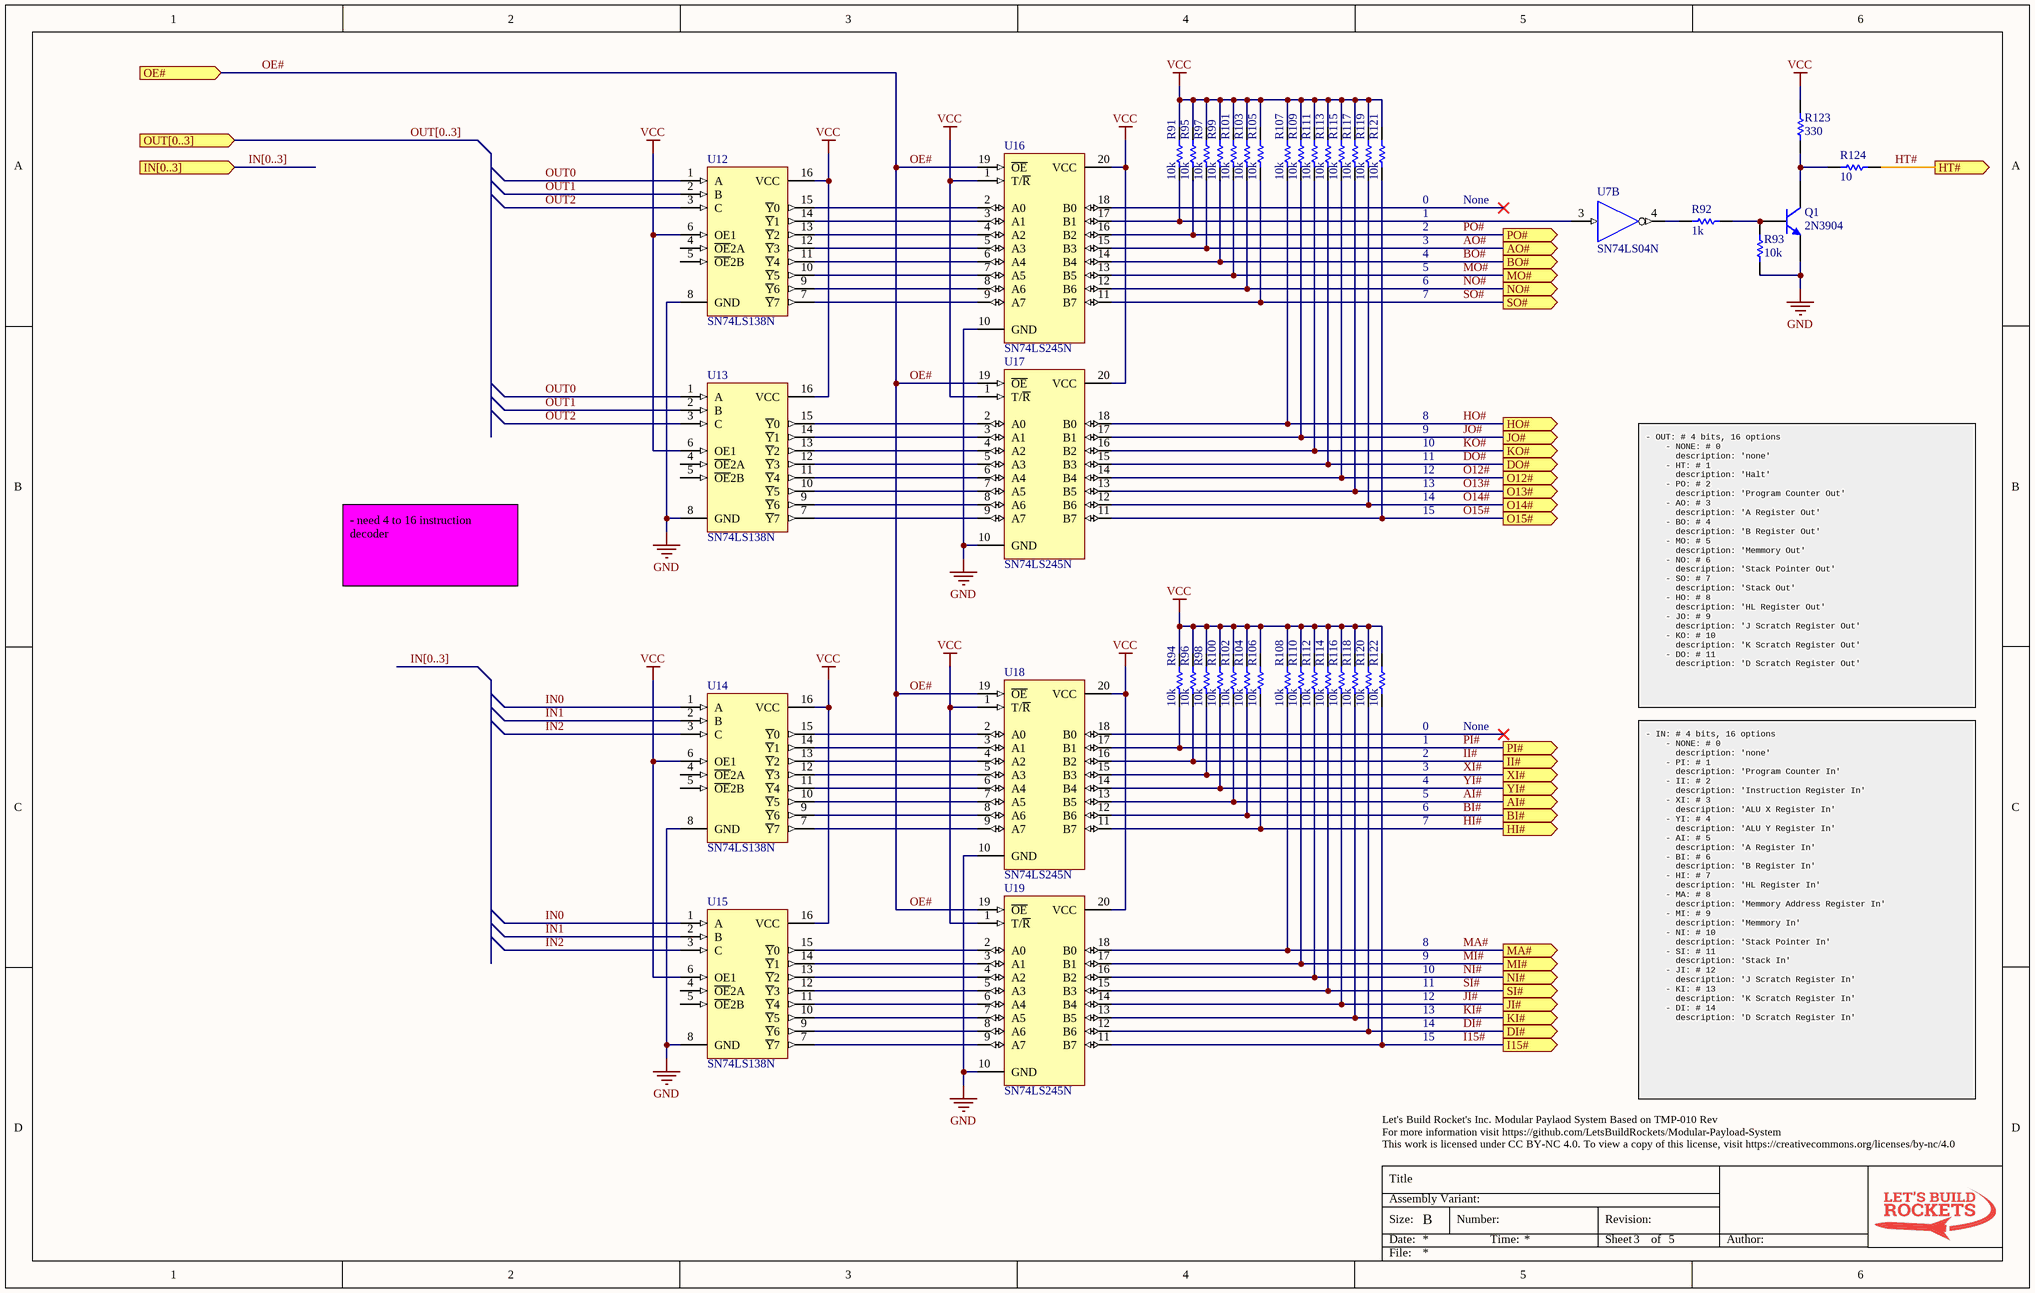
[diagram p3: Decode.SchDoc]

### Parts
Q1  2N3904  [TO-92A]
R91  value 10k  [AXIAL-0.3]  (hidden comment: Res1)
R92  value 1k  [AXIAL-0.3]  (hidden comment: Res1)
R93  value 10k  [AXIAL-0.3]  (hidden comment: Res1)
R94  value 10k  [AXIAL-0.3]  (hidden comment: Res1)
R95  value 10k  [AXIAL-0.3]  (hidden comment: Res1)
R96  value 10k  [AXIAL-0.3]  (hidden comment: Res1)
R97  value 10k  [AXIAL-0.3]  (hidden comment: Res1)
R98  value 10k  [AXIAL-0.3]  (hidden comment: Res1)
R99  value 10k  [AXIAL-0.3]  (hidden comment: Res1)
R100  value 10k  [AXIAL-0.3]  (hidden comment: Res1)
R101  value 10k  [AXIAL-0.3]  (hidden comment: Res1)
R102  value 10k  [AXIAL-0.3]  (hidden comment: Res1)
R103  value 10k  [AXIAL-0.3]  (hidden comment: Res1)
R104  value 10k  [AXIAL-0.3]  (hidden comment: Res1)
R105  value 10k  [AXIAL-0.3]  (hidden comment: Res1)
R106  value 10k  [AXIAL-0.3]  (hidden comment: Res1)
R107  value 10k  [AXIAL-0.3]  (hidden comment: Res1)
R108  value 10k  [AXIAL-0.3]  (hidden comment: Res1)
R109  value 10k  [AXIAL-0.3]  (hidden comment: Res1)
R110  value 10k  [AXIAL-0.3]  (hidden comment: Res1)
R111  value 10k  [AXIAL-0.3]  (hidden comment: Res1)
R112  value 10k  [AXIAL-0.3]  (hidden comment: Res1)
R113  value 10k  [AXIAL-0.3]  (hidden comment: Res1)
R114  value 10k  [AXIAL-0.3]  (hidden comment: Res1)
R115  value 10k  [AXIAL-0.3]  (hidden comment: Res1)
R116  value 10k  [AXIAL-0.3]  (hidden comment: Res1)
R117  value 10k  [AXIAL-0.3]  (hidden comment: Res1)
R118  value 10k  [AXIAL-0.3]  (hidden comment: Res1)
R119  value 10k  [AXIAL-0.3]  (hidden comment: Res1)
R120  value 10k  [AXIAL-0.3]  (hidden comment: Res1)
R121  value 10k  [AXIAL-0.3]  (hidden comment: Res1)
R122  value 10k  [AXIAL-0.3]  (hidden comment: Res1)
R123  value 330  [AXIAL-0.3]  (hidden comment: Res1)
R124  value 10  [AXIAL-0.3]  (hidden comment: Res1)
U7  SN74LS04N  [N014]  (part B of 6)
U12  SN74LS138N  [N016]
U13  SN74LS138N  [N016]
U14  SN74LS138N  [N016]
U15  SN74LS138N  [N016]
U16  SN74LS245N  [N020]
U17  SN74LS245N  [N020]
U18  SN74LS245N  [N020]
U19  SN74LS245N  [N020]

### Ports
AI# (out), AO# (out), BI# (out), BO# (out), DI# (out), DO# (out), HI# (out), HO# (out), HT# (out), I15# (out), II# (out), IN[0..3] (in), JI# (out), JO# (out), KI# (out), KO# (out), MA# (out), MI# (out), MO# (out), NI# (out), NO# (out), O12# (out), O13# (out), O14# (out), O15# (out), OE# (in), OUT[0..3] (in), PI# (out), PO# (out), SI# (out), SO# (out), XI# (out), YI# (out)

### Nets
GND: Q1.1(E) R93.2 U7.7(GND) U12.8(GND) U13.8(GND) U14.8(GND) U15.8(GND) U16.10(GND) U17.10(GND) U18.10(GND) U19.10(GND)
VCC: R91.2 R94.2 R95.2 R96.2 R97.2 R98.2 R99.2 R100.2 R101.2 R102.2 R103.2 R104.2 R105.2 R106.2 R107.2 R108.2 R109.2 R110.2 R111.2 R112.2 R113.2 R114.2 R115.2 R116.2 R117.2 R118.2 R119.2 R120.2 R121.2 R122.2 R123.1 U7.14(VCC) U12.6(OE1) U12.16(VCC) U13.6(OE1) U13.16(VCC) U14.6(OE1) U14.16(VCC) U15.6(OE1) U15.16(VCC) U16.1(T/~{R}) U16.20(VCC) U17.1(T/~{R}) U17.20(VCC) U18.1(T/~{R}) U18.20(VCC) U19.1(T/~{R}) U19.20(VCC)
AI#: R102.1 U18.13(B5) ; port AI#
AO#: R97.1 U16.15(B3) ; port AO#
BI#: R104.1 U18.12(B6) ; port BI#
BO#: R99.1 U16.14(B4) ; port BO#
DI#: R120.1 U19.12(B6) ; port DI#
DO#: R113.1 U17.15(B3) ; port DO#
HI#: R106.1 U18.11(B7) ; port HI#
HO#: R107.1 U17.18(B0) ; port HO#
HT#: R124.1 ; port HT#
I15#: R122.1 U19.11(B7) ; port I15#
II#: R96.1 U18.16(B2) ; port II#
IN0: U14.1(A) U15.1(A)
IN1: U14.2(B) U15.2(B)
IN2: U14.3(C) U15.3(C)
JI#: R116.1 U19.14(B4) ; port JI#
JO#: R109.1 U17.17(B1) ; port JO#
KI#: R118.1 U19.13(B5) ; port KI#
KO#: R111.1 U17.16(B2) ; port KO#
MA#: R108.1 U19.18(B0) ; port MA#
MI#: R110.1 U19.17(B1) ; port MI#
MO#: R101.1 U16.13(B5) ; port MO#
NI#: R112.1 U19.16(B2) ; port NI#
NO#: R103.1 U16.12(B6) ; port NO#
O12#: R115.1 U17.14(B4) ; port O12#
O13#: R117.1 U17.13(B5) ; port O13#
O14#: R119.1 U17.12(B6) ; port O14#
O15#: R121.1 U17.11(B7) ; port O15#
OE#: U16.19(~{OE}) U17.19(~{OE}) U18.19(~{OE}) U19.19(~{OE}) ; port OE#
OUT0: U12.1(A) U13.1(A)
OUT1: U12.2(B) U13.2(B)
OUT2: U12.3(C) U13.3(C)
PI#: R94.1 U18.17(B1) ; port PI#
PO#: R95.1 U16.16(B2) ; port PO#
SI#: R114.1 U19.15(B3) ; port SI#
SO#: R105.1 U16.11(B7) ; port SO#
XI#: R98.1 U18.15(B3) ; port XI#
YI#: R100.1 U18.14(B4) ; port YI#
NetQ1_2: Q1.2(B) R92.1 R93.1
NetQ1_3: Q1.3(C) R123.2 R124.2
NetR91_1: R91.1 U7.3(A) U16.17(B1)
NetR92_2: R92.2 U7.4(Y)
NetU12_7: U12.7(~{Y}7) U16.9(A7)
NetU12_9: U12.9(~{Y}6) U16.8(A6)
NetU12_10: U12.10(~{Y}5) U16.7(A5)
NetU12_11: U12.11(~{Y}4) U16.6(A4)
NetU12_12: U12.12(~{Y}3) U16.5(A3)
NetU12_13: U12.13(~{Y}2) U16.4(A2)
NetU12_14: U12.14(~{Y}1) U16.3(A1)
NetU12_15: U12.15(~{Y}0) U16.2(A0)
NetU13_7: U13.7(~{Y}7) U17.9(A7)
NetU13_9: U13.9(~{Y}6) U17.8(A6)
NetU13_10: U13.10(~{Y}5) U17.7(A5)
NetU13_11: U13.11(~{Y}4) U17.6(A4)
NetU13_12: U13.12(~{Y}3) U17.5(A3)
NetU13_13: U13.13(~{Y}2) U17.4(A2)
NetU13_14: U13.14(~{Y}1) U17.3(A1)
NetU13_15: U13.15(~{Y}0) U17.2(A0)
NetU14_7: U14.7(~{Y}7) U18.9(A7)
NetU14_9: U14.9(~{Y}6) U18.8(A6)
NetU14_10: U14.10(~{Y}5) U18.7(A5)
NetU14_11: U14.11(~{Y}4) U18.6(A4)
NetU14_12: U14.12(~{Y}3) U18.5(A3)
NetU14_13: U14.13(~{Y}2) U18.4(A2)
NetU14_14: U14.14(~{Y}1) U18.3(A1)
NetU14_15: U14.15(~{Y}0) U18.2(A0)
NetU15_7: U15.7(~{Y}7) U19.9(A7)
NetU15_9: U15.9(~{Y}6) U19.8(A6)
NetU15_10: U15.10(~{Y}5) U19.7(A5)
NetU15_11: U15.11(~{Y}4) U19.6(A4)
NetU15_12: U15.12(~{Y}3) U19.5(A3)
NetU15_13: U15.13(~{Y}2) U19.4(A2)
NetU15_14: U15.14(~{Y}1) U19.3(A1)
NetU15_15: U15.15(~{Y}0) U19.2(A0)

Not connected (* = marked no-connect by the designer): U12 4(~{OE}2A) 5(~{OE}2B); U13 4(~{OE}2A) 5(~{OE}2B); U14 4(~{OE}2A) 5(~{OE}2B); U15 4(~{OE}2A) 5(~{OE}2B); U16 18(B0)*; U18 18(B0)*

### Buses and harness runs
bus IN[0..3]
bus IN[0..3] = port IN[0..3]
bus OUT[0..3] = port OUT[0..3]

### Notes on the sheet
- 0
- 1
- 2
- None
- 3
- 4
- 5
- 6
- 7
- 8
- 9
- 10
- 11
- 12
- 13
- 14
- 15
- - need 4 to 16 instruction decoder
- - OUT: # 4 bits, 16 options
  - NONE: # 0
  description: 'none'
  - HT: # 1
  description: 'Halt'
  - PO: # 2
  description: 'Program Counter Out'
  - AO: # 3
  description: 'A Register Out'
  - BO: # 4
  description: 'B Register Out'
  - MO: # 5
  description: 'Memmory Out'
  - NO: # 6
  description: 'Stack Pointer Out'
  - SO: # 7
  description: 'Stack Out'
  - HO: # 8
  description: 'HL Register Out'
  - JO: # 9
  description: 'J Scratch Register Out'
  - KO: # 10
  description: 'K Scratch Register Out'
  - DO: # 11
  description: 'D Scratch Register Out'
- - IN: # 4 bits, 16 options
  - NONE: # 0
  description: 'none'
  - PI: # 1
  description: 'Program Counter In'
  - II: # 2
  description: 'Instruction Register In'
  - XI: # 3
  description: 'ALU X Register In'
  - YI: # 4
  description: 'ALU Y Register In'
  - AI: # 5
  description: 'A Register In'
  - BI: # 6
  description: 'B Register In'
  - HI: # 7
  description: 'HL Register In'
  - MA: # 8
  description: 'Memmory Address Register In'
  - MI: # 9
  description: 'Memmory In'
  - NI: # 10
  description: 'Stack Pointer In'
  - SI: # 11
  description: 'Stack In'
  - JI: # 12
  description: 'J Scratch Register In'
  - KI: # 13
  description: 'K Scratch Register In'
  - DI: # 14
  description: 'D Scratch Register In'
- Let's Build Rocket's Inc. Modular Paylaod System Based on TMP-010 Rev
  For more information visit https://github.com/LetsBuildRockets/Modular-Payload-System
  This work is licensed under CC BY-NC 4.0. To view a copy of this license, visit https://creativecommons.org/licenses/by-nc/4.0
- Title
- Size:
- Date:
- Assembly Variant:
- B
- Number:
- Time:
- Revision:
- Sheet
- of
- Author:
- File:

### Library data of the parts
Q1 = 2N3904: NPN General Purpose Amplifier; Published: 8-Jun-2000; LatestRevisionDate: 15-Jan-2003; LatestRevisionNote: PCB Footprint 'BCY-W3/D4.7' replaced; DatasheetVersion: 1997; PackageVersion: Sep-1998; PackageReference: TO-92A; Publisher: Altium Limited; PackageDescription: TO, Flat Index; 3 In-Line, Axial Leads; Body Dia. 4.5mm; Leads 0.51 x 0.48 mm (max); ComponentLink1Description: Manufacturer Link; ComponentLink1URL: http://www.fairchildsemi.com/; ComponentLink2Description: Datasheet; ComponentLink2URL: http://www.fairchildsemi.com/ds/2N%2F2N3904.pdf
R91-R124 = Res1: Resistor; Published: 8-Jun-2000; LatestRevisionDate: 17-Jul-2002; LatestRevisionNote: Re-released for DXP Platform.; PackageReference: AXIAL-0.3; Publisher: Altium Limited; PackageDescription: Axial Device, Thru-Hole; 2 Leads; 0.3 in Pin Spacing
U7 = SN74LS04N: Hex Inverter; Published: 8-Jun-2000; LatestRevisionDate: 04-Mar-2005; LatestRevisionNote: Stylized 3D Model Added.; DatasheetVersion: Mar-1988; PackageVersion: Oct-1995; PackageReference: N014; Publisher: Altium Limited; PackageDescription: DIP; 14 Leads; Row Spacing 7.62 mm; Pitch 2.54 mm; ComponentLink1Description: Manufacturer Link; ComponentLink1URL: http://www.ti.com/; ComponentLink2Description: Datasheet; ComponentLink2URL: http://www-s.ti.com/sc/ds/sn74ls04.pdf
U12-U15 = SN74LS138N: 3-Line to 8-Line Decoder / Demultiplexer; Published: 8-Jun-2000; LatestRevisionDate: 04-Mar-2005; LatestRevisionNote: Stylized 3D Model Added.; DatasheetVersion: Mar-1988; PackageVersion: Oct-1995; PackageReference: N016; Publisher: Altium Limited; PackageDescription: DIP; 16 Leads; Row Spacing 7.62 mm; Pitch 2.54 mm; Code_JEDEC: MS-001-BB; ComponentLink1Description: Manufacturer Link; ComponentLink1URL: http://www.ti.com/; ComponentLink2Description: Datasheet; ComponentLink2URL: http://www-s.ti.com/sc/ds/sn74ls138.pdf
U16-U19 = SN74LS245N: as U8 on sheet Top; Published: 8-Jun-2000; LatestRevisionDate: 04-Mar-2005; LatestRevisionNote: Stylized 3D Model Added.; DatasheetVersion: Mar-1988; PackageVersion: Oct-1995; PackageReference: N020; Publisher: Altium Limited; PackageDescription: DIP; 20 Leads; Row Spacing 7.62 mm; Pitch 2.54 mm; ComponentLink1Description: Manufacturer Link; ComponentLink1URL: http://www.ti.com/; ComponentLink2Description: Datasheet; ComponentLink2URL: http://www-s.ti.com/sc/ds/sn74ls245.pdf

## Nets that join several sheets
GND: Top (8 pins), Microcode (29 pins), G1 (18 pins), Decode (11 pins), G2 (18 pins)
VCC: Top (TP14.1 U7.14 U11.14), Microcode (23 pins), Decode (48 pins)
AT#: Top (TP6.1), Microcode (R86.1 U3.17)
CLK: Top (TP2.1), G1 (R49_G1.1), G2 (R49_G2.1)
CO: Top (R63.1), Microcode (U1.29 U2.29 U3.29)
HT#: Top (TP5.1), Decode (R124.1)
IN0: Top (R51.1), Decode (U14.1 U15.1)
IN1: Top (R52.1), Decode (U14.2 U15.2)
IN2: Top (R53.1), Decode (U14.3 U15.3)
INST0: Top (R33.1), Microcode (U1.6 U2.6 U3.6)
INST1: Top (R34.1), Microcode (U1.5 U2.5 U3.5)
INST2: Top (R35.1), Microcode (U1.27 U2.27 U3.27)
INST3: Top (R36.1), Microcode (U1.26 U2.26 U3.26)
INST4: Top (R37.1), Microcode (U1.23 U2.23 U3.23)
INST5: Top (R38.1), Microcode (U1.25 U2.25 U3.25)
INST6: Top (R39.1), Microcode (U1.4 U2.4 U3.4)
INST7: Top (R40.1), Microcode (U1.28 U2.28 U3.28)
LM#: Top (TP3.1), Microcode (R83.1 U2.20)
LOGIC.D0: Top (R33.2), G1 (R1_G1.1)
LOGIC.D0: Top (R51.2), G2 (R1_G2.1)
LOGIC.D1: Top (R34.2), G1 (R2_G1.1)
LOGIC.D1: Top (R52.2), G2 (R2_G2.1)
LOGIC.D2: Top (R35.2), G1 (R3_G1.1)
LOGIC.D2: Top (R53.2), G2 (R3_G2.1)
LOGIC.D3: Top (R36.2), G1 (R4_G1.1)
LOGIC.D3: Top (R54.2), G2 (R4_G2.1)
LOGIC.D4: Top (R37.2), G1 (R5_G1.1)
LOGIC.D4: Top (R55.2), G2 (R5_G2.1)
LOGIC.D5: Top (R38.2), G1 (R6_G1.1)
LOGIC.D5: Top (R56.2), G2 (R6_G2.1)
LOGIC.D6: Top (R39.2), G1 (R7_G1.1)
LOGIC.D6: Top (R57.2), G2 (R7_G2.1)
LOGIC.D7: Top (R40.2), G1 (R8_G1.1)
LOGIC.D7: Top (R58.2), G2 (R8_G2.1)
LOGIC.D8: Top (R41.2), G1 (R17_G1.1)
LOGIC.D8: Top (R59.2), G2 (R17_G2.1)
LOGIC.D9: Top (R42.2), G1 (R18_G1.1)
LOGIC.D9: Top (R60.2), G2 (R18_G2.1)
LOGIC.D10: Top (R43.2), G1 (R19_G1.1)
LOGIC.D10: Top (R61.2), G2 (R19_G2.1)
LOGIC.D11: Top (R44.2), G1 (R20_G1.1)
LOGIC.D11: Top (R62.2), G2 (R20_G2.1)
LOGIC.D12: Top (R45.2), G1 (R21_G1.1)
LOGIC.D12: Top (R63.2), G2 (R21_G2.1)
LOGIC.D13: Top (R46.2), G1 (R22_G1.1)
LOGIC.D13: Top (R64.2), G2 (R22_G2.1)
LOGIC.D14: Top (R47.2), G1 (R23_G1.1)
LOGIC.D14: Top (R65.2), G2 (R23_G2.1)
LOGIC.D15: Top (R48.2), G1 (R24_G1.1)
LOGIC.D15: Top (R66.2), G2 (R24_G2.1)
NF: Top (R65.1), Microcode (U1.2 U2.2 U3.2)
OE#: Top (R66.1 U7.2 U11.2), Decode (U16.19 U17.19 U18.19 U19.19)
OE#: Top (U11.3), Microcode (U1.22 U2.22 U3.22)
OUT0: Top (R55.1), Decode (U12.1 U13.1)
OUT1: Top (R56.1), Decode (U12.2 U13.2)
OUT2: Top (R57.1), Decode (U12.3 U13.3)
RU#: Top (TP1.1), Microcode (R85.1 U2.21)
ZF: Top (R64.1), Microcode (U1.3 U2.3 U3.3)